# Altium schematic sheet NFC.SchDoc
size A
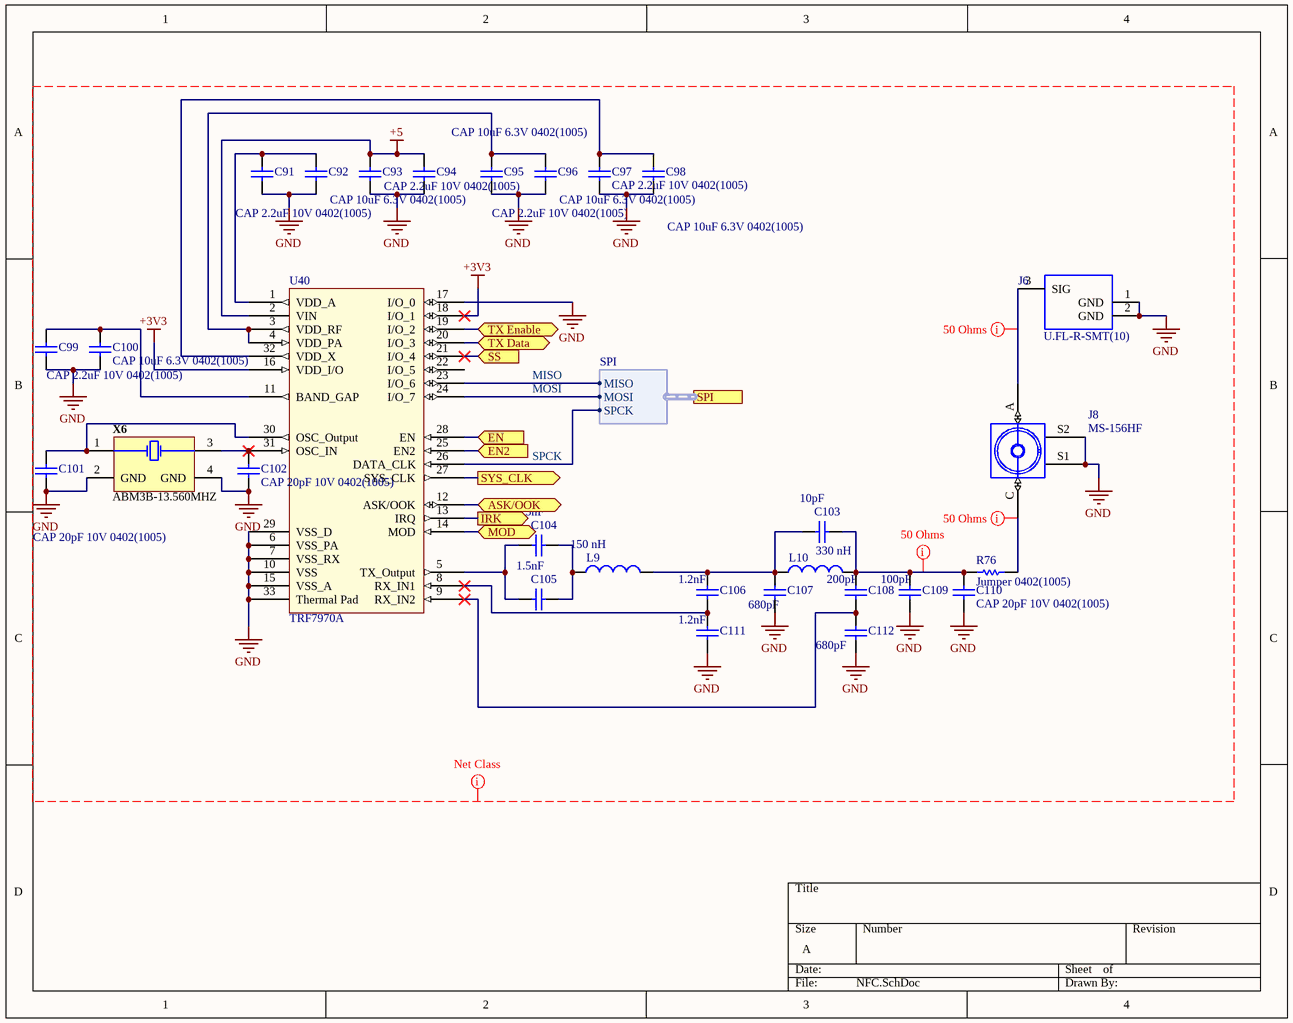
[diagram p0: NFC.SchDoc]

## Parts
C91  CAP 2.2uF 10V 0402(1005)  [CAPC0402(1005)60_L]
C92  CAP 10uF 6.3V 0402(1005)  [CAPC0402(1005)60_L]
C93  CAP 2.2uF 10V 0402(1005)  [CAPC0402(1005)60_L]
C94  CAP 10uF 6.3V 0402(1005)  [CAPC0402(1005)60_L]
C95  CAP 2.2uF 10V 0402(1005)  [CAPC0402(1005)60_L]
C96  CAP 10uF 6.3V 0402(1005)  [CAPC0402(1005)60_L]
C97  CAP 2.2uF 10V 0402(1005)  [CAPC0402(1005)60_L]
C98  CAP 10uF 6.3V 0402(1005)  [CAPC0402(1005)60_L]
C99  CAP 2.2uF 10V 0402(1005)  [CAPC0402(1005)60_L]
C100  CAP 10uF 6.3V 0402(1005)  [CAPC0402(1005)60_L]
C101  CAP 20pF 10V 0402(1005)  [CAPC0402(1005)60_L]
C102  CAP 20pF 10V 0402(1005)  [CAPC0402(1005)60_L]
C103  value 10pF  [CAPC0402(1005)60_L]  (hidden comment: CAP 10pF 10V 0402(1005))
C104  value 1.5nF  [CAPC0402(1005)60_L]  (hidden comment: CAP 1.5nF 10V 0402(1005))
C105  value 1.5nF  [CAPC0402(1005)60_L]  (hidden comment: CAP 1.5nF 10V 0402(1005))
C106  value 1.2nF  [CAPC0402(1005)60_L]  (hidden comment: CAP 1.2nF 10V 0402(1005))
C107  value 680pF  [CAPC0402(1005)60_L]  (hidden comment: CAP 680pF 6.3V 0402(1005))
C108  value 200pF  [CAPC0402(1005)60_L]  (hidden comment: CAP 200pF 10V 0402(1005))
C109  value 100pF  [CAPC0402(1005)60_L]  (hidden comment: CAP 100pF 10V 0402(1005))
C110  CAP 20pF 10V 0402(1005)  [CAPC0402(1005)60_L]
C111  value 1.2nF  [CAPC0402(1005)60_L]  (hidden comment: CAP 1.2nF 10V 0402(1005))
C112  value 680pF  [CAPC0402(1005)60_L]  (hidden comment: CAP 680pF 6.3V 0402(1005))
J6  U.FL-R-SMT(10)  [HRS-U.FL-R-SMT_V]
J8  MS-156HF  [MS-156HF]
L9  Inductance: 150 nH  [COIL-1008CS_V]  (hidden comment: 1008CS-1501X_FLC)
L10  Inductance: 330 nH  [COIL-1008CS_V]  (hidden comment: 1008CS-3301X_FLC)
R76  Jumper 0402(1005)  [RESC0402(1005)_L]
U40  TRF7970A  [QFN50P500X500X100_HS-33N]
X6  ABM3B-13.560MHZ  [ABRA-ABM3B-4_V]

## Ports
ASK/OOK (bidir), EN2 (in), EN (in), IRK (out), MOD (bidir), SPI (harness SPI), SS (in), SYS_CLK (out), TX Data (bidir), TX Enable (bidir)

## Harnesses
SPI: MISO, MOSI, SPCK

## Nets
+3V3: U40.16(VDD_I/O) U40.18(I/O_1)
+5: C93.2 C94.2 U40.2(VIN)
GND: C91.1 C92.1 C93.1 C94.1 C95.1 C96.1 C97.1 C98.1 C99.1 C100.1 C101.2 C102.2 C107.1 C109.1 C110.2 C111.1 C112.1 J6.1(GND) J6.2(GND) J8.S1 J8.S2 U40.6(VSS_PA) U40.7(VSS_RX) U40.10(VSS) U40.15(VSS_A) U40.17(I/O_0) U40.29(VSS_D) U40.33(Thermal_Pad) X6.2(GND) X6.4(GND)
ASK/OOK: U40.12(ASK/OOK) ; port ASK/OOK
EN: U40.28(EN) ; port EN
EN2: U40.25(EN2) ; port EN2
IRK: U40.13(IRQ) ; port IRK
MISO: U40.23(I/O_6) ; port SPI.MISO
MOD: U40.14(MOD) ; port MOD
MOSI: U40.24(I/O_7) ; port SPI.MOSI
SPCK: U40.26(DATA_CLK) ; port SPI.SPCK
SS: U40.21(I/O_4) ; port SS
SYS_CLK: U40.27(SYS_CLK) ; port SYS_CLK
TX Data: U40.20(I/O_3) ; port TX Data
TX Enable: U40.19(I/O_2) ; port TX Enable
NetC91_2: C91.2 C92.2 U40.1(VDD_A)
NetC95_2: C95.2 C96.2 U40.3(VDD_RF) U40.4(VDD_PA)
NetC97_2: C97.2 C98.2 U40.32(VDD_X)
NetC99_2: C99.2 C100.2 U40.11(BAND_GAP)
NetC101_1: C101.1 U40.30(OSC_Output) X6.1(X1)
NetC102_1: C102.1 U40.31(OSC_IN) X6.3(X2)
NetC103_1: C103.1 C106.2 C107.2 L9.2 L10.1
NetC103_2: C103.2 C108.2 C109.2 C110.1 L10.2 R76.1
NetC104_1: C104.1 C105.1 U40.5(TX_Output)
NetC104_2: C104.2 C105.2 L9.1
NetC106_1: C106.1 C111.2 U40.8(RX_IN1)
NetC108_1: C108.1 C112.2 U40.9(RX_IN2)
NetJ6_3: J6.3(SIG) J8.A
NetJ8_C: J8.C R76.2

Not connected (* = marked no-connect by the designer): U40 22(I/O_5)

## Layout directives
net class 50_Ohms: NetC103_2, NetJ6_3, NetJ8_C
net class NFC: +3V3, +5, GND, MISO, MOSI, SPCK

## Library data of the parts
C91 C93 C95 C97 C99 = CMP-1034-02128-1: CAP 2.2uF 10V ±20% 0402 (1005 Metric) Thickness 0.6mm SMD; Case-EIA: 0402; Tolerance: Â±20%; Case-Metric: 1005; Value: 2.2uF; Rated Voltage: 10 V; Technology: SMT; Max Thickness: 0.6 mm
C92 C94 C96 C98 C100 = CMP-1034-02138-1: CAP 10uF 6.3V ±20% 0402 (1005 Metric) Thickness 0.6mm SMD; Case-Metric: 1005; Case-EIA: 0402; Tolerance: Â±20%; Rated Voltage: 6.3 V; Technology: SMT; Max Thickness: 0.6 mm; Value: 10uF
C101 C102 C110 = CMP-1034-00874-1: CAP 20pF 10V ±5% 0402 (1005 Metric) Thickness 0.6mm SMD; Case-EIA: 0402; Tolerance: Â±5%; Case-Metric: 1005; Value: 20pF; Rated Voltage: 10 V; Technology: SMT; Max Thickness: 0.6 mm
C103 = CMP-1034-00703-1: CAP 10pF 10V ±10% 0402 (1005 Metric) Thickness 0.6mm SMD; Tolerance: Â±10%; Case-EIA: 0402; Case-Metric: 1005; Rated Voltage: 10 V; Technology: SMT; Max Thickness: 0.6 mm
C104 C105 = CMP-1034-01671-1: CAP 1.5nF 10V ±5% 0402 (1005 Metric) Thickness 0.6mm SMD; Tolerance: Â±5%; Case-EIA: 0402; Case-Metric: 1005; Technology: SMT; Max Thickness: 0.6 mm; Rated Voltage: 10 V
C106 C111 = CMP-1034-01643-1: CAP 1.2nF 10V ±5% 0402 (1005 Metric) Thickness 0.6mm SMD; Tolerance: Â±5%; Case-EIA: 0402; Case-Metric: 1005; Technology: SMT; Rated Voltage: 10 V; Max Thickness: 0.6 mm
C107 C112 = CMP-1034-01542-1: CAP 680pF 6.3V ±10% 0402 (1005 Metric) Thickness 0.6mm SMD; Case-EIA: 0402; Tolerance: Â±10%; Case-Metric: 1005; Rated Voltage: 6.3 V; Max Thickness: 0.6 mm; Technology: SMT
C108 = CMP-1034-01342-1: CAP 200pF 10V ±1% 0402 (1005 Metric) Thickness 0.6mm SMD; Case-EIA: 0402; Tolerance: Â±1%; Case-Metric: 1005; Technology: SMT; Rated Voltage: 10 V; Max Thickness: 0.6 mm
C109 = CMP-1034-01232-1: CAP 100pF 10V ±10% 0402 (1005 Metric) Thickness 0.6mm SMD; Case-EIA: 0402; Case-Metric: 1005; Tolerance: Â±10%; Rated Voltage: 10 V; Max Thickness: 0.6 mm; Technology: SMT
J6 = CMP-0029-00003-1: Ultra Small Surface Mount Coaxial Connector, 50 Ohm, -40 to 90 degC, 3-Pin SMD, RoHS, Tape and Reel; Current Rating: 3 A; DatasheetVersion: Aug-16; Mount: Through Hole; Contact Material: Bronze; Length: 101.19 mm; Radiation Hardening: No; Height: 8.13 mm; ComponentLink1Description: Manufacturer URL; Pins: 80; Package Quantity: 50; ComponentLink2URL: https://www.hirose.com/product/en/download_file/key_name/U.FL/category/Catalog/doc_file_id/31697/?file_category_id=4&item_id=15&is_series=1; Lead Pitch: 2.54 mm; Max Operating Temperature: 105degC; Width: 4.88 mm; RoHSCompliant: True; Contact Plating: Tin; PackageReference: U.FL-R-SMT; Packaging: Bulk; Contact Finish: Lead; PackageDescription: 3-Pin Surface Mount Device, Body 2.6 x 2.6 mm; Min Operating Temperature: -65degC; ComponentLink1URL: https://www.hirose.com; ComponentLink2Description: Datasheet; Colour: Black
J8 = MS-156HF: Subminiature Coaxial Swtich, 1.6mm High, DC - 6GHz
L9 = CMP-00022-0015-A.1: Chip Inductor, 150 nH, +/- 1%, -40 to 125 degC, 2-Pin SMD, RoHS, Tape and Reel; ComponentLink1Description: Manufacturer URL; ComponentLink1URL: http://www.coilcraft.com/; ComponentLink2Description: Datasheet; ComponentLink2URL: http://www.coilcraft.com/pdfs/1008cs.pdf; DatasheetVersion: Oct-15; Mounting Technology: Surface Mount; PackageDescription: 2-Pin Surface Mount Device, Body 2.92 x 2.79 mm; PartNumber: 1008CS-1501X_FLC; RoHSCompliant: TRUE
L10 = CMP-00022-0019-A.1: Chip Inductor, 330 nH, +/- 1%, -40 to 125 degC, 2-Pin SMD, RoHS, Tape and Reel; ComponentLink1Description: Manufacturer URL; ComponentLink1URL: http://www.coilcraft.com/; ComponentLink2Description: Datasheet; ComponentLink2URL: http://www.coilcraft.com/pdfs/1008cs.pdf; DatasheetVersion: Oct-15; Mounting Technology: Surface Mount; PackageDescription: 2-Pin Surface Mount Device, Body 2.92 x 2.79 mm; PartNumber: 1008CS-3301X_FLC; RoHSCompliant: TRUE
R76 = CMP-1011-00001-1: Jumper 0402 (1005 Metric); Case-Metric: 1005; Value: 0.00 Ohm; Power: None; Case-EIA: 0402; Technology: SMT; Tolerance: None
X6 = CMP-1688-00008-1: Ceramic SMD Crystal, 13.56 MHz, +/- 20 ppm, 50 Ohm, -20 to 70 degC, 4-Pin SMD, RoHS, Tape and Reel; Impedance: 50 Ohm; Mating Cycles: 30; Contact Material: Brass; Contact Plating: Gold; PackageReference: ABM3B; Min Operating Temperature: -40 degC; ComponentLink2Description: Datasheet; Radiation Hardening: No; DatasheetVersion: Aug-15; Packaging: Tape and Reel; Length: 2.6 mm; Package Quantity: 2500; REACH SVHC: Unknown; PackageDescription: 4-Pin Surface Mount Device, Body 5 x 3.2 mm; Weight: 0.001058 oz; ComponentLink2URL: http://www.abracon.com/Resonators/abm3b.pdf; ComponentLink1Description: Manufacturer URL; Width: 3 mm; RoHSCompliant: true; Fastening Type: Snap; Max Operating Temperature: 155 degC; ComponentLink1URL: http://www.abracon.com/; Frequency: 13.56 MHz; Height: 1.244 mm; Mount: Surface Mount